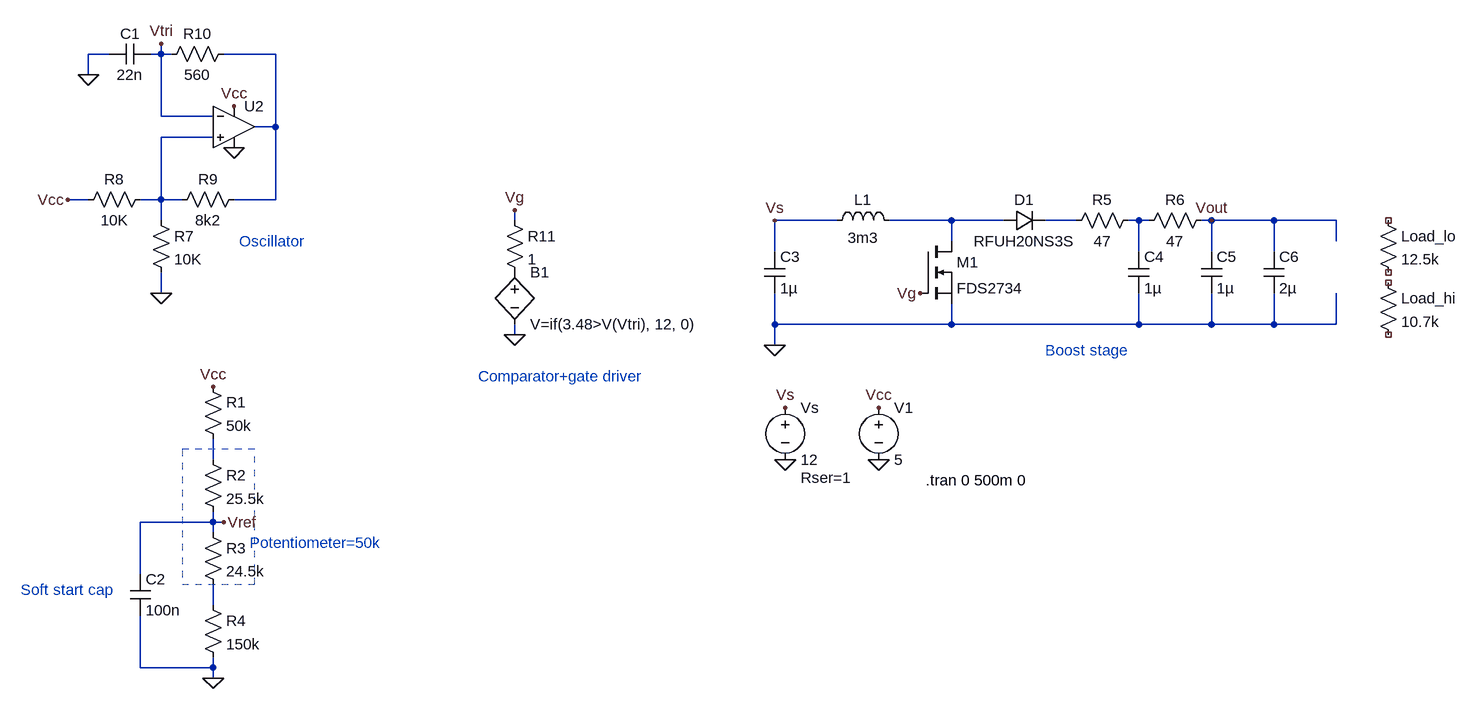
[diagram p0: schematic boost_v2_nofb.asc]
boost_v2_nofb.asc, the LTspice schematic file:
Version 4
SHEET 1 1412 948
WIRE -704 -112 -736 -112
WIRE -624 -112 -624 -128
WIRE -624 -112 -640 -112
WIRE -608 -112 -624 -112
WIRE -448 -112 -528 -112
WIRE -736 -80 -736 -112
WIRE -624 -16 -624 -112
WIRE -544 -16 -624 -16
WIRE -448 0 -448 -112
WIRE -448 0 -480 0
WIRE -544 16 -624 16
WIRE -736 112 -768 112
WIRE -624 112 -624 16
WIRE -624 112 -656 112
WIRE -592 112 -624 112
WIRE -448 112 -448 0
WIRE -448 112 -512 112
WIRE -624 144 -624 112
WIRE -80 144 -80 128
WIRE 416 144 320 144
WIRE 592 144 496 144
WIRE 672 144 592 144
WIRE 784 144 736 144
WIRE 880 144 864 144
WIRE 896 144 880 144
WIRE 992 144 976 144
WIRE 1088 144 992 144
WIRE 1184 144 1088 144
WIRE 592 176 592 144
WIRE 1184 176 1184 144
WIRE 320 192 320 144
WIRE 880 192 880 144
WIRE 992 192 992 144
WIRE 1088 192 1088 144
WIRE -624 256 -624 224
WIRE 320 304 320 256
WIRE 592 304 592 272
WIRE 592 304 320 304
WIRE 880 304 880 256
WIRE 880 304 592 304
WIRE 992 304 992 256
WIRE 992 304 880 304
WIRE 1088 304 1088 256
WIRE 1088 304 992 304
WIRE 1184 304 1184 256
WIRE 1184 304 1088 304
WIRE -80 320 -80 304
WIRE 320 336 320 304
WIRE -544 512 -544 480
WIRE -544 608 -544 592
WIRE -544 608 -656 608
WIRE -528 608 -544 608
WIRE -544 624 -544 608
WIRE -656 688 -656 608
WIRE -544 736 -544 704
WIRE -656 832 -656 752
WIRE -544 832 -544 816
WIRE -544 832 -656 832
WIRE -544 848 -544 832
FLAG 336 512 0
FLAG 336 432 Vs
FLAG 992 144 Vout
FLAG 320 144 Vs
FLAG 320 336 0
FLAG -624 256 0
FLAG -512 -32 Vcc
FLAG -512 32 0
FLAG -736 -80 0
FLAG -768 112 Vcc
FLAG -624 -128 Vtri
FLAG -80 128 Vg
FLAG 544 256 Vg
FLAG -80 320 0
FLAG 480 512 0
FLAG 480 432 Vcc
FLAG -544 848 0
FLAG -544 400 Vcc
FLAG -528 608 Vref
SYMBOL ind 400 160 R270
WINDOW 0 32 56 VTop 2
WINDOW 3 5 56 VBottom 2
SYMATTR InstName L1
SYMATTR Value 3m3
SYMBOL nmos 544 176 R0
SYMATTR InstName M1
SYMATTR Value FDS2734
SYMBOL diode 672 160 R270
WINDOW 0 32 32 VTop 2
WINDOW 3 0 32 VBottom 2
SYMATTR InstName D1
SYMATTR Value RFUH20NS3S
SYMBOL cap 304 192 R0
SYMATTR InstName C3
SYMATTR Value 1µ
SYMBOL cap 976 192 R0
SYMATTR InstName C5
SYMATTR Value 1µ
SYMBOL voltage 336 416 R0
WINDOW 123 0 0 Left 0
WINDOW 39 24 124 Left 2
SYMATTR SpiceLine Rser=1
SYMATTR InstName Vs
SYMATTR Value 12
SYMBOL res 1248 128 R0
SYMATTR InstName Load_lo
SYMATTR Value 12.5k
SYMBOL res -640 128 R0
SYMATTR InstName R7
SYMATTR Value 10K
SYMBOL res -640 96 R90
WINDOW 0 0 56 VBottom 2
WINDOW 3 32 56 VTop 2
SYMATTR InstName R8
SYMATTR Value 10K
SYMBOL res -496 96 R90
WINDOW 0 0 56 VBottom 2
WINDOW 3 32 56 VTop 2
SYMATTR InstName R9
SYMATTR Value 8k2
SYMBOL res -512 -128 R90
WINDOW 0 0 56 VBottom 2
WINDOW 3 32 56 VTop 2
SYMATTR InstName R10
SYMATTR Value 560
SYMBOL cap -640 -128 R90
WINDOW 0 0 32 VBottom 2
WINDOW 3 32 32 VTop 2
SYMATTR InstName C1
SYMATTR Value 22n
SYMATTR SpiceLine IC=2
SYMBOL OpAmps\\UniversalOpAmp2 -512 0 R0
SYMATTR InstName U2
SYMBOL bv -80 208 R0
SYMATTR InstName B1
SYMATTR Value V=if(3.48>V(Vtri), 12, 0)
SYMBOL res -96 128 R0
SYMATTR InstName R11
SYMATTR Value 1
SYMBOL res 880 128 R90
WINDOW 0 0 56 VBottom 2
WINDOW 3 32 56 VTop 2
SYMATTR InstName R5
SYMATTR Value 47
SYMBOL cap 864 192 R0
SYMATTR InstName C4
SYMATTR Value 1µ
SYMBOL res 992 128 R90
WINDOW 0 0 56 VBottom 2
WINDOW 3 32 56 VTop 2
SYMATTR InstName R6
SYMATTR Value 47
SYMBOL cap 1072 192 R0
SYMATTR InstName C6
SYMATTR Value 2µ
SYMBOL voltage 480 416 R0
WINDOW 123 0 0 Left 0
WINDOW 39 0 0 Left 0
SYMATTR InstName V1
SYMATTR Value 5
SYMBOL res -560 384 R0
SYMATTR InstName R1
SYMATTR Value 50k
SYMBOL res -560 496 R0
SYMATTR InstName R2
SYMATTR Value 25.5k
SYMBOL res -560 608 R0
SYMATTR InstName R3
SYMATTR Value 24.5k
SYMBOL res -560 720 R0
SYMATTR InstName R4
SYMATTR Value 150k
SYMBOL cap -672 688 R0
SYMATTR InstName C2
SYMATTR Value 100n
SYMATTR SpiceLine IC=0
SYMBOL res 1248 224 R0
SYMATTR InstName Load_hi
SYMATTR Value 10.7k
TEXT 552 544 Left 2 !.tran 0 500m 0
TEXT -136 384 Left 2 ;Comparator+gate driver
TEXT 736 344 Left 2 ;Boost stage
TEXT -504 176 Left 2 ;Oscillator
TEXT -488 640 Left 2 ;Potentiometer=50k
TEXT -840 712 Left 2 ;Soft start cap
RECTANGLE Normal -592 704 -480 496 2

The netlist it stands for:
* boost_v2_nofb.asc
L1 Vs N003 3m3
M1 N003 Vg 0 0 FDS2734
D1 N003 N004 RFUH20NS3S
C3 Vs 0 1µ
C5 Vout 0 1µ
Vs Vs 0 12 Rser=1
R§Load_lo NC_01 NC_02 12.5k
R7 N002 0 10K
R8 N002 Vcc 10K
R9 N001 N002 8k2
R10 N001 Vtri 560
C1 Vtri 0 22n IC=2
XU2 N002 Vtri Vcc 0 N001 level2 Avol=1Meg GBW=10Meg Slew=10Meg Ilimit=25m Rail=0 Vos=0 En=0 Enk=0 In=0 Ink=0 Rin=500Meg  ; pins In+ In- V+ V- OUT
B1 P001 0 V=if(3.48>V(Vtri), 12, 0)
R11 Vg P001 1
R5 N005 N004 47
C4 N005 0 1µ
R6 Vout N005 47
C6 Vout 0 2µ
V1 Vcc 0 5
R1 Vcc N006 50k
R2 N006 Vref 25.5k
R3 Vref N007 24.5k
R4 N007 0 150k
C2 Vref 0 100n IC=0
R§Load_hi NC_03 NC_04 10.7k
.model D D
.lib standard.dio
.model NMOS NMOS
.model PMOS PMOS
.lib standard.mos
.tran 0 500m 0
* Comparator+gate driver
* Boost stage
* Oscillator
* Potentiometer=50k
* Soft start cap
.lib UniversalOpAmp2.lib
.backanno
.end